# Altium schematic sheet BI4.SchDoc
size 420 x 297 mm; DocumentNumber: 9; SheetNumber: 9; SheetTotal: 13; DecimalNumber: СНАБ.468222.001 ЭЗ
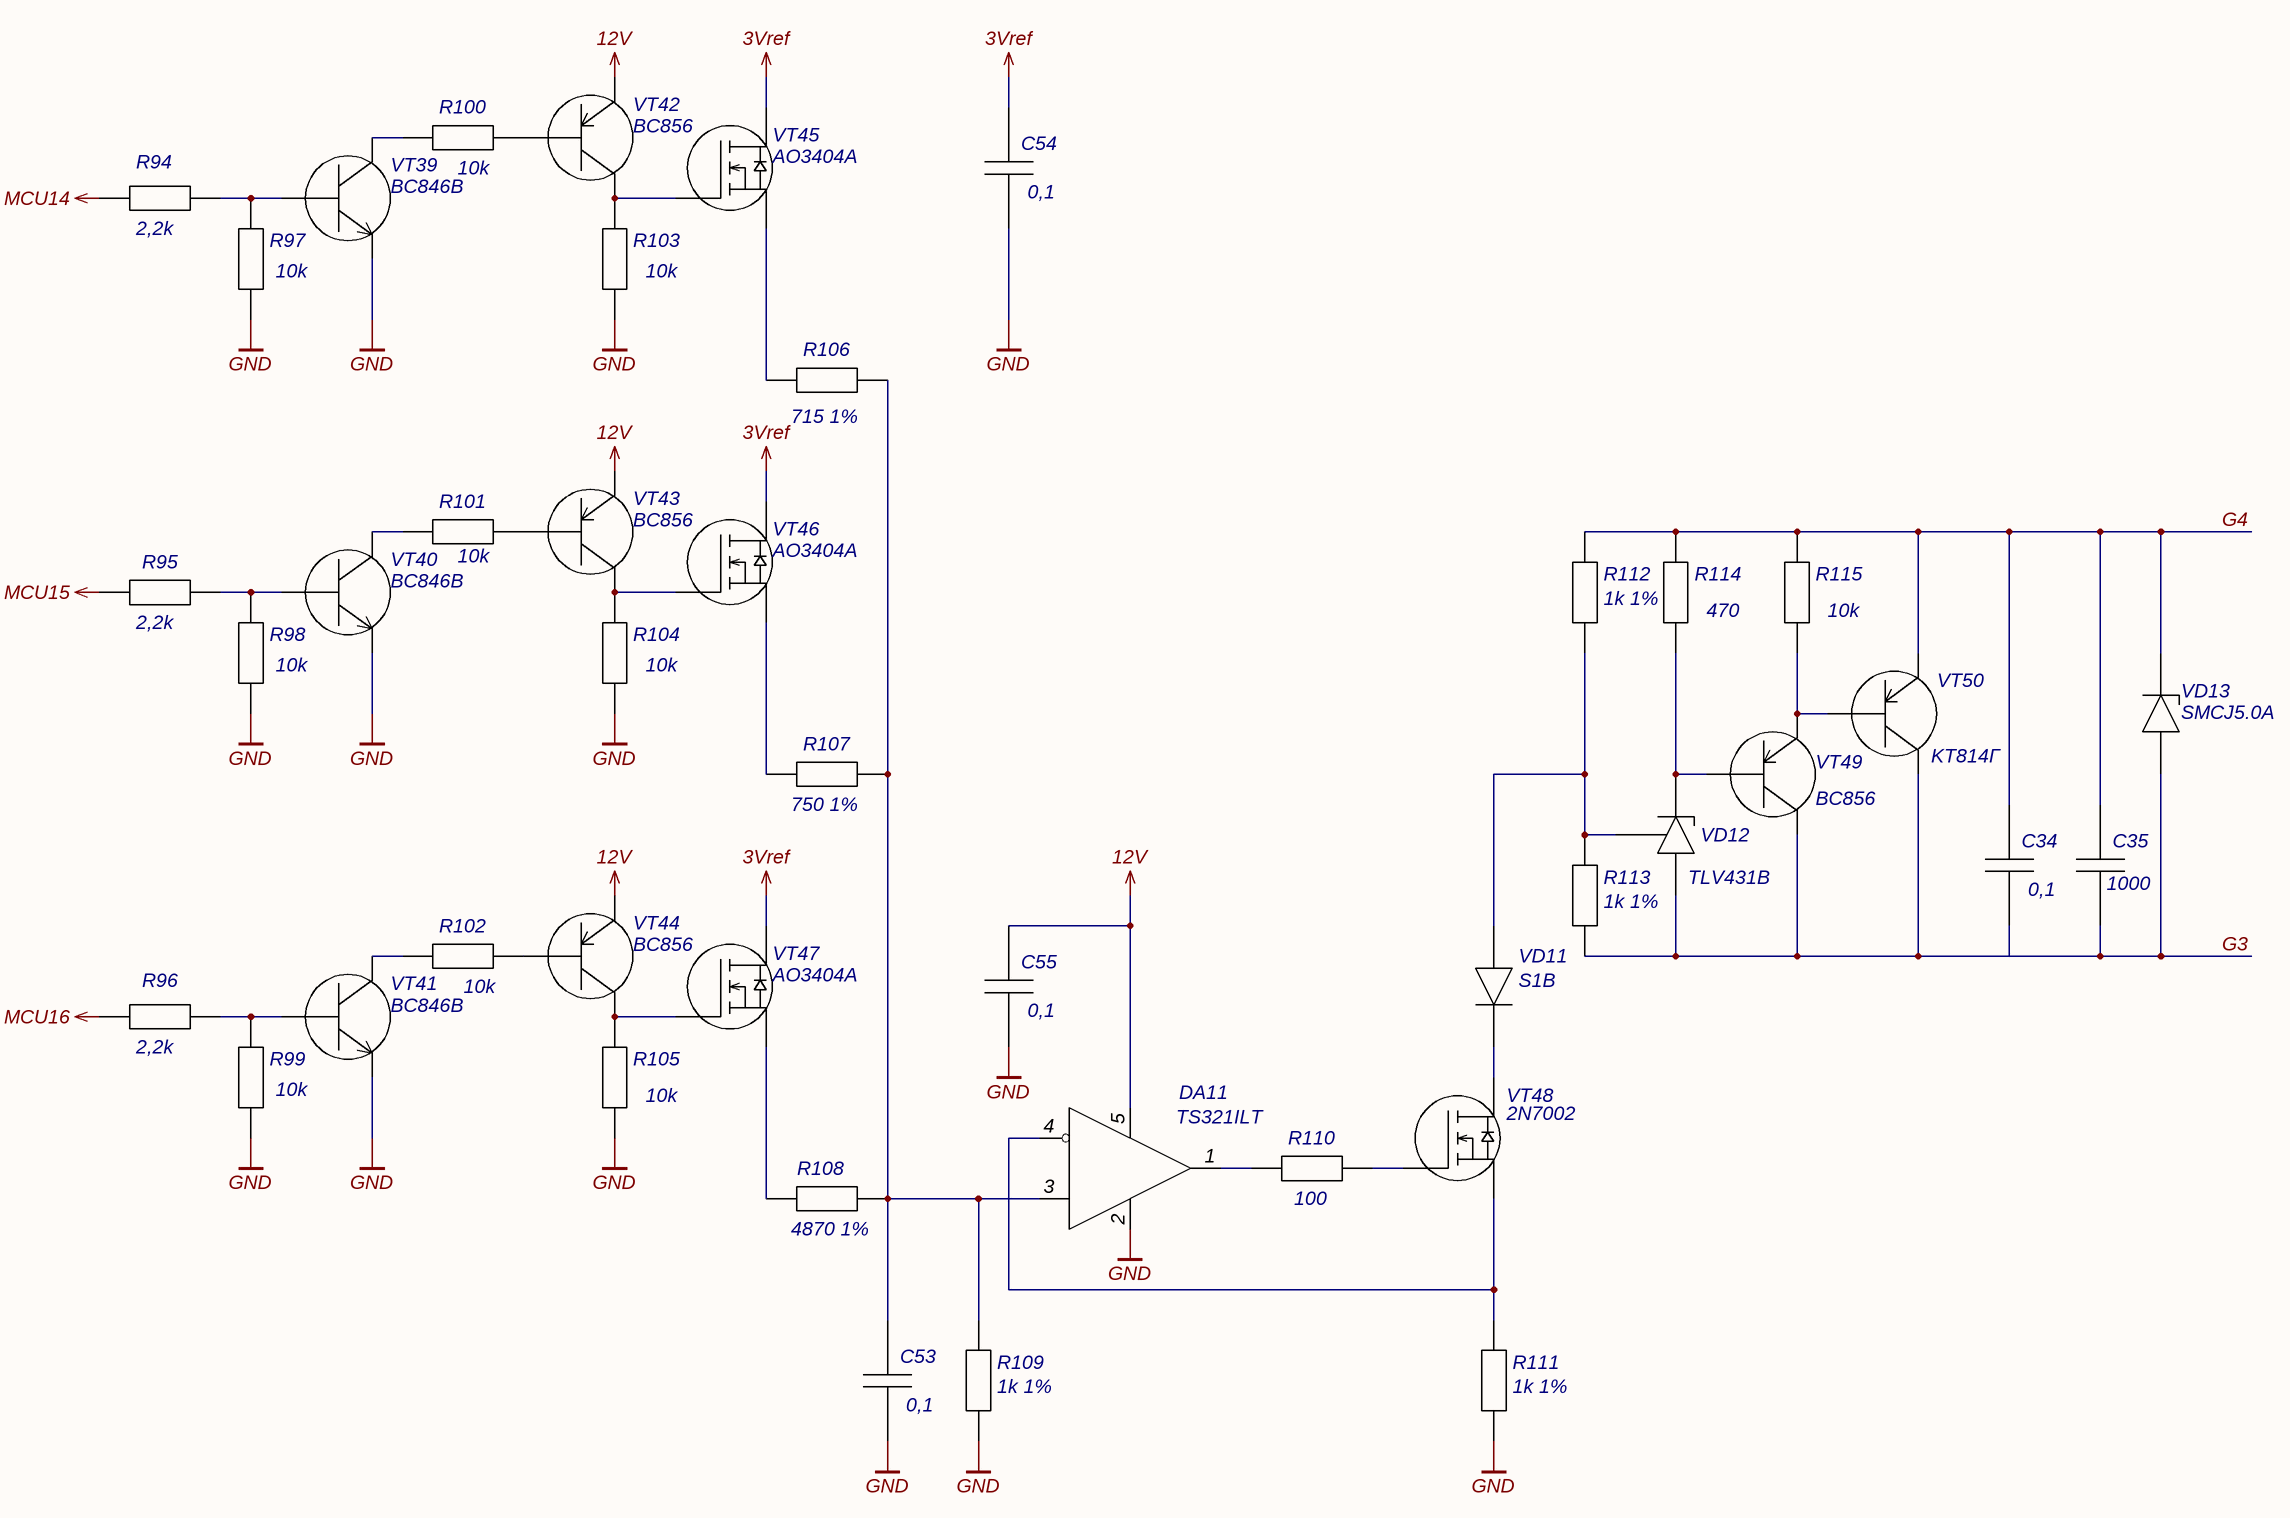
[diagram p0: BI4.SchDoc]

## Parts
C34  0,1  [C0603]
C35  1000  [C0603]
C53  0,1  [C0603]
C54  0,1  [C0603]
C55  0,1  [C0603]
DA11  TS321ILT  [SOT-23-5]
R94  2,2k  [R0603]
R95  2,2k  [R0603]
R96  2,2k  [R0603]
R97  10k  [R0603]
R98  10k  [R0603]
R99  10k  [R0603]
R100  10k  [R0603]
R101  10k  [R0603]
R102  10k  [R0603]
R103  10k  [R0603]
R104  10k  [R0603]
R105  10k  [R0603]
R106  715 1%  [R0603]
R107  750 1%  [R0603]
R108  4870 1%  [R0603]
R109  1k 1%  [R0603]
R110  100  [R0603]
R111  1k 1%  [R0603]
R112  1k 1%  [R0603]
R113  1k 1%  [R0603]
R114  470  [R0603]
R115  10k  [R0603]
VD11  S1B  [DO-214AC]
VD12  TLV431B  [SOT-23]
VD13  SMCJ5.0A  [DO-214AB]
VT39  BC846B  [SOT-23]
VT40  BC846B  [SOT-23]
VT41  BC846B  [SOT-23]
VT42  BC856  [SOT-23]
VT43  BC856  [SOT-23]
VT44  BC856  [SOT-23]
VT45  AO3404A  [SOT-23]
VT46  AO3404A  [SOT-23]
VT47  AO3404A  [SOT-23]
VT48  2N7002  [SOT-23]
VT49  BC856  [SOT-23]
VT50  KT814Г  [TO-126]

## Nets
3Vref: C54.2 VT45.2(D) VT46.2(D) VT47.2(D)
12V: C55.2 DA11.5(Vcc) VT42.1 VT43.1 VT44.1
GND: C53.1 C54.1 C55.1 DA11.2(GND) R97.1 R98.1 R99.1 R103.1 R104.1 R105.1 R109.1 R111.1 VT39.2(E) VT40.2(E) VT41.2(E)
MCU14: R94.1
MCU15: R95.1
MCU16: R96.1
G3: C34.1 C35.1 R113.1 VD12.1 VD13.1 VT49.2 VT50.2
G4: C34.2 C35.2 R112.2 R114.2 R115.2 VD13.2 VT50.1
NetC53_2: C53.2 DA11.3(+) R106.2 R107.2 R108.2 R109.2
NetDA11_1: DA11.1(OUT) R110.1
NetDA11_4: DA11.4(-) R111.2 VT48.3(S)
NetR94_2: R94.2 R97.2 VT39.1(B)
NetR95_2: R95.2 R98.2 VT40.1(B)
NetR96_2: R96.2 R99.2 VT41.1(B)
NetR100_1: R100.1 VT39.3(C)
NetR100_2: R100.2 VT42.3
NetR101_1: R101.1 VT40.3(C)
NetR101_2: R101.2 VT43.3
NetR102_1: R102.1 VT41.3(C)
NetR102_2: R102.2 VT44.3
NetR103_2: R103.2 VT42.2 VT45.1(G)
NetR104_2: R104.2 VT43.2 VT46.1(G)
NetR105_2: R105.2 VT44.2 VT47.1(G)
NetR106_1: R106.1 VT45.3(S)
NetR107_1: R107.1 VT46.3(S)
NetR108_1: R108.1 VT47.3(S)
NetR110_2: R110.2 VT48.1(G)
NetR112_1: R112.1 R113.2 VD11.1 VD12.3
NetR114_1: R114.1 VD12.2 VT49.3
NetR115_1: R115.1 VT49.1 VT50.3
NetVD11_2: VD11.2 VT48.2(D)

## Notes on the sheet
- Подп. и дата
- Инв.№ дубл.
- Взам.инв.№
- Подп.и дата
- Инв.№ подл.
- Изм.
- Лист
- № докум.
- Подп.
- Дата
- Копировал
- Формат  A3

## Library data of the parts
C34 C35 C53-C55 = Chip Capasitor: Чип-конденсатор
  C34 C53-C55: Value: 0,1
  C35: Value: 1000
DA11 = TS321ILT: 1х Операционный усилитель; Manufacurer: STMicroelectronics; Case: SOT-23-5; Name: TS321ILT; Datasheet: https://static.chipdip.ru/lib/710/DOC011710227.pdf
R94-R105 R110 R114 R115 = Chip Resistor: Чип-резистор
  R94-R96: Value: 2,2k
  R97-R105 R115: Value: 10k
  R110: Value: 100
  R114: Value: 470
R106 = Chip Resistor: Чип-резистор; Partnumber: RC0603FR-07715RL; Value: 715 1%; URL: https://www.chipdip.ru/product0/8002000768
R107 = Chip Resistor: Чип-резистор; Partnumber: RC0603FR-07750RL; Value: 750 1%; URL: https://www.chipdip.ru/product/0.1w-0603-750-om-1
R108 = Chip Resistor: Чип-резистор; Partnumber: RC0603FR-074K87L; Value: 4870 1%; URL: https://www.chipdip.ru/product0/8002000679
R109 R111-R113 = Chip Resistor: Чип-резистор; Partnumber: CRCW06031K00FKEAC; Value: 1k 1%; URL: https://www.chipdip.ru/product0/8002019285
VD11 = S1B: Диод выпрямительный, 100В; Manufacturer: Diotec Semiconductor; Case: DO-214AC; Name: S1B; Datasheet: https://static.chipdip.ru/lib/113/DOC032113174.pdf
VD12 = TLV431B: Стабилитрон регулируемый, 6В; Manufacturer: Texas Instruments; Case: SOT-23; Name: TLV431B; Datasheet: https://static.chipdip.ru/lib/985/DOC012985043.pdf
VD13 = SMCJ5.0A: Защитный диод, 5В; Manufacturer: UTD Semiconductor Co.,Ltd; Case: DO-201; Name: SMCJ5.0A; Datasheet: https://static.chipdip.ru/lib/863/DOC025863760.pdf
VT39-VT41 = BC846B: Транзистор биполярный NPN, 65В; Manufacturer: Nexperia B.V.; Case: SOT-23; Name: BC846B; Datasheet: https://static.chipdip.ru/lib/551/DOC012551042.pdf
VT42-VT44 VT49 = BC856: Транзистор биполярный PNP, 65В; Manufacturer: Nexperia; Case: SOT-23; Name: BC856; Datasheet: https://static.chipdip.ru/lib/365/DOC004365998.pdf
VT45-VT47 = AO3404A: Транзистор MOSFET N-канал, 30В; Manufacturer: UTD Semiconductor Co.,Ltd; Case: SOT-23; Name: AO3404A; Datasheet: https://static.chipdip.ru/lib/906/DOC012906979.pdf
VT48 = 2N7002: Транзистор MOSFET N-канал, 60В; Manufacturer: UTD Semiconductor Co.; Case: SOT-23; Name: 2N7002; Datasheet: https://static.chipdip.ru/lib/301/DOC021301072.pdf
VT50 = KT814Г: Транзистор биполярный PNP, 100В; Manufacturer: АО «ГРУППА КРЕМНИЙ ЭЛ»; TU: аАО.336.184 ТУ/02; Case: TO-126; Name: KT814Г; Datasheet: https://static.chipdip.ru/lib/404/DOC047404057.pdf